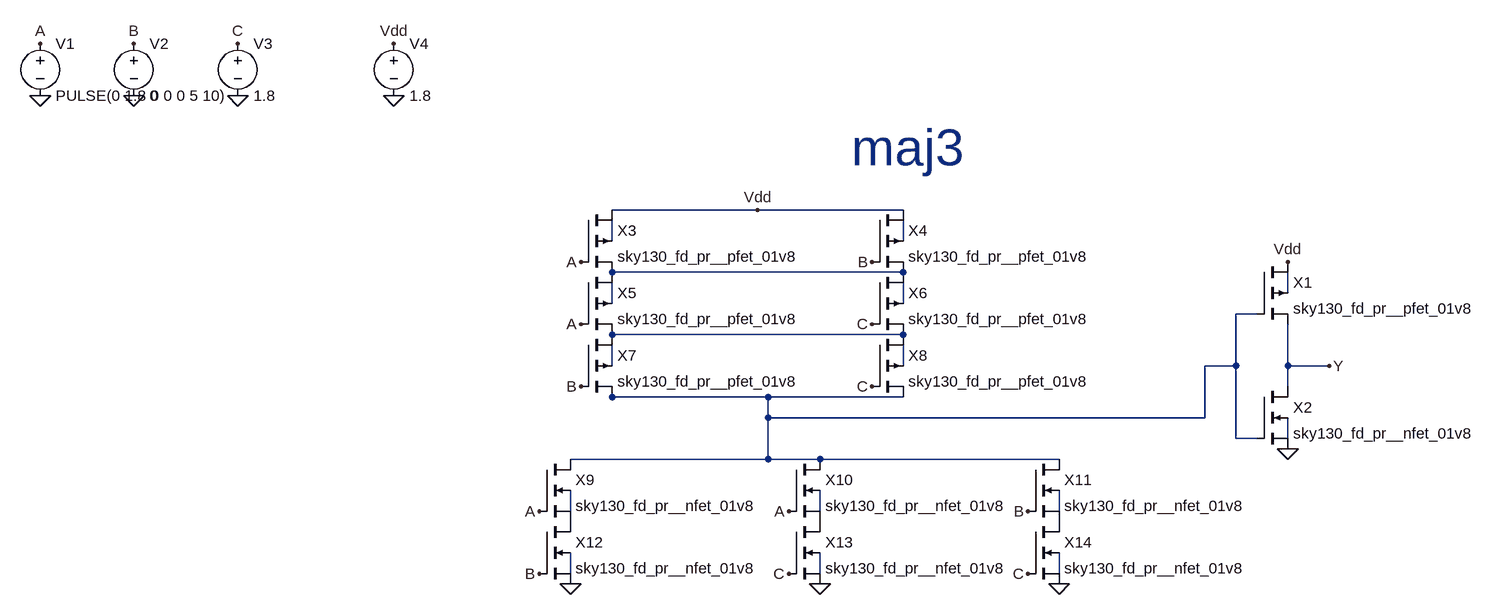
[diagram p0: schematic maj3.asc]
maj3.asc, the LTspice schematic file:
Version 4
SHEET 1 2064 680
WIRE 928 -192 704 -192
WIRE 1152 -192 928 -192
WIRE 704 -144 704 -176
WIRE 1152 -144 1152 -176
WIRE 1152 -96 704 -96
WIRE 1744 -64 1744 -96
WIRE 704 -48 704 -80
WIRE 1152 -48 1152 -80
WIRE 1696 -32 1664 -32
WIRE 1152 0 704 0
WIRE 704 48 704 16
WIRE 1152 48 1152 16
WIRE 1664 48 1664 -32
WIRE 1664 48 1616 48
WIRE 1744 48 1744 -16
WIRE 1808 48 1744 48
WIRE 1744 80 1744 48
WIRE 704 96 704 80
WIRE 944 96 704 96
WIRE 1152 96 944 96
WIRE 944 128 944 96
WIRE 1616 128 1616 48
WIRE 1616 128 944 128
WIRE 1664 160 1664 48
WIRE 1696 160 1664 160
WIRE 1744 160 1744 128
WIRE 944 192 944 128
WIRE 944 192 640 192
WIRE 1024 192 944 192
WIRE 1392 192 1024 192
WIRE 640 272 640 240
WIRE 1024 272 1024 240
WIRE 1392 272 1392 240
WIRE 640 368 640 336
WIRE 1024 368 1024 336
WIRE 1392 368 1392 336
FLAG -176 -368 0
FLAG -32 -368 0
FLAG 128 -368 0
FLAG -176 -448 A
FLAG -32 -448 B
FLAG 128 -448 C
FLAG 368 -448 Vdd
FLAG 368 -368 0
FLAG 928 -192 Vdd
FLAG 640 384 0
FLAG 1024 384 0
FLAG 1392 384 0
FLAG 656 -112 A
FLAG 656 -16 A
FLAG 592 272 A
FLAG 976 272 A
FLAG 1104 -112 B
FLAG 656 80 B
FLAG 1344 272 B
FLAG 592 368 B
FLAG 1104 -16 C
FLAG 1104 80 C
FLAG 976 368 C
FLAG 1344 368 C
FLAG 1744 176 0
FLAG 1744 -112 Vdd
FLAG 1808 48 Y
SYMBOL pmos4 1696 -112 R0
SYMATTR InstName X1
SYMATTR Value2 l=0.13u w=4u
SYMATTR Value sky130_fd_pr__pfet_01v8
SYMBOL nmos4 1696 80 R0
SYMATTR InstName X2
SYMATTR Value2 l=0.13u w=2u
SYMATTR Value sky130_fd_pr__nfet_01v8
SYMBOL pmos4 656 -192 R0
SYMATTR InstName X3
SYMATTR Value2 l=0.13u w=4u
SYMATTR Value sky130_fd_pr__pfet_01v8
SYMBOL pmos4 1104 -192 R0
SYMATTR InstName X4
SYMATTR Value2 l=0.13u w=4u
SYMATTR Value sky130_fd_pr__pfet_01v8
SYMBOL pmos4 656 -96 R0
SYMATTR InstName X5
SYMATTR Value2 l=0.13u w=4u
SYMATTR Value sky130_fd_pr__pfet_01v8
SYMBOL pmos4 1104 -96 R0
SYMATTR InstName X6
SYMATTR Value2 l=0.13u w=4u
SYMATTR Value sky130_fd_pr__pfet_01v8
SYMBOL pmos4 656 0 R0
SYMATTR InstName X7
SYMATTR Value2 l=0.13u w=4u
SYMATTR Value sky130_fd_pr__pfet_01v8
SYMBOL pmos4 1104 0 R0
SYMATTR InstName X8
SYMATTR Value2 l=0.13u w=4u
SYMATTR Value sky130_fd_pr__pfet_01v8
SYMBOL voltage -176 -464 R0
WINDOW 123 0 0 Left 0
WINDOW 39 0 0 Left 0
SYMATTR InstName V1
SYMATTR Value PULSE(0 1.8 0 0 0 5 10)
SYMBOL voltage -32 -464 R0
WINDOW 123 0 0 Left 0
WINDOW 39 0 0 Left 0
SYMATTR InstName V2
SYMATTR Value 0
SYMBOL voltage 128 -464 R0
WINDOW 123 0 0 Left 0
WINDOW 39 0 0 Left 0
SYMATTR InstName V3
SYMATTR Value 1.8
SYMBOL voltage 368 -464 R0
WINDOW 123 0 0 Left 0
WINDOW 39 0 0 Left 0
SYMATTR InstName V4
SYMATTR Value 1.8
SYMBOL nmos4 592 192 R0
SYMATTR InstName X9
SYMATTR Value2 l=0.13u w=2u
SYMATTR Value sky130_fd_pr__nfet_01v8
SYMBOL nmos4 976 192 R0
SYMATTR InstName X10
SYMATTR Value2 l=0.13u w=2u
SYMATTR Value sky130_fd_pr__nfet_01v8
SYMBOL nmos4 1344 192 R0
SYMATTR InstName X11
SYMATTR Value2 l=0.13u w=2u
SYMATTR Value sky130_fd_pr__nfet_01v8
SYMBOL nmos4 592 288 R0
SYMATTR InstName X12
SYMATTR Value2 l=0.13u w=2u
SYMATTR Value sky130_fd_pr__nfet_01v8
SYMBOL nmos4 976 288 R0
SYMATTR InstName X13
SYMATTR Value2 l=0.13u w=2u
SYMATTR Value sky130_fd_pr__nfet_01v8
SYMBOL nmos4 1344 288 R0
SYMATTR InstName X14
SYMATTR Value2 l=0.13u w=2u
SYMATTR Value sky130_fd_pr__nfet_01v8
TEXT 1072 -288 Left 6 ;maj3

The netlist it stands for:
* maj3.asc
M§X1 Vdd N007 Y N004 sky130_fd_pr__pfet_01v8 l=0.13u w=4u
M§X2 Y N007 0 N011 sky130_fd_pr__nfet_01v8 l=0.13u w=2u
M§X3 Vdd A N003 N001 sky130_fd_pr__pfet_01v8 l=0.13u w=4u
M§X4 Vdd B N003 N002 sky130_fd_pr__pfet_01v8 l=0.13u w=4u
M§X5 N003 A N008 N005 sky130_fd_pr__pfet_01v8 l=0.13u w=4u
M§X6 N003 C N008 N006 sky130_fd_pr__pfet_01v8 l=0.13u w=4u
M§X7 N008 B N007 N009 sky130_fd_pr__pfet_01v8 l=0.13u w=4u
M§X8 N008 C N007 N010 sky130_fd_pr__pfet_01v8 l=0.13u w=4u
V1 A 0 PULSE(0 1.8 0 0 0 5 10)
V2 B 0 0
V3 C 0 1.8
V4 Vdd 0 1.8
M§X9 N007 A P001 N012 sky130_fd_pr__nfet_01v8 l=0.13u w=2u
M§X10 N007 A P002 N013 sky130_fd_pr__nfet_01v8 l=0.13u w=2u
M§X11 N007 B P003 N014 sky130_fd_pr__nfet_01v8 l=0.13u w=2u
M§X12 P001 B 0 N015 sky130_fd_pr__nfet_01v8 l=0.13u w=2u
M§X13 P002 C 0 N016 sky130_fd_pr__nfet_01v8 l=0.13u w=2u
M§X14 P003 C 0 N017 sky130_fd_pr__nfet_01v8 l=0.13u w=2u
.model NMOS NMOS
.model PMOS PMOS
.lib standard.mos
* maj3
.backanno
.end